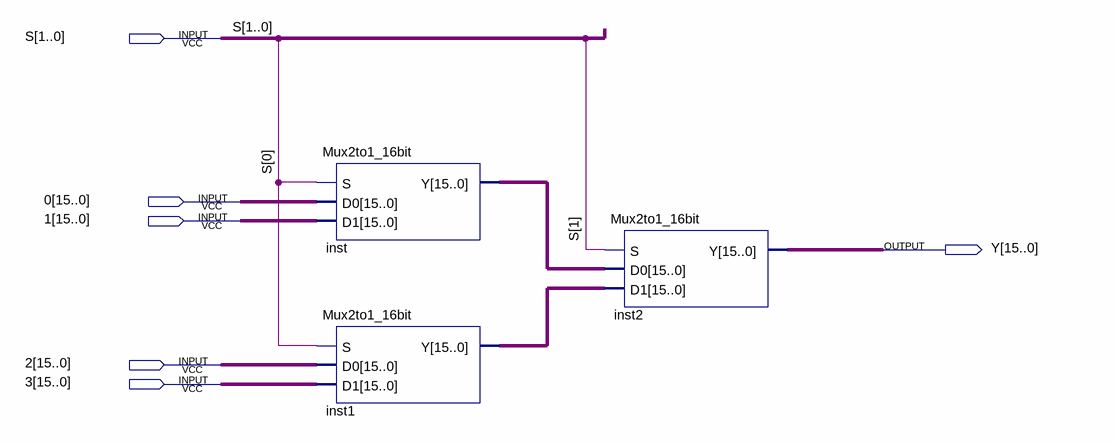
[diagram p0: schematic sheet]
// Quartus schematic Mux4to1_16bit.bdf as structural Verilog: 3 symbols, 6 pins
module Mux4to1_16bit (
  input  [1:0] S,
  input  [15:0] \0 ,
  input  [15:0] \1 ,
  input  [15:0] \2 ,
  input  [15:0] \3 ,
  output [15:0] Y
);

  wire [15:0] inst1_y, inst_y;

  Mux2to1_16bit inst (.S(S[0]), .D0(\0 ), .D1(\1 ), .Y(inst_y));
  Mux2to1_16bit inst1 (.S(S[0]), .D0(\2 ), .D1(\3 ), .Y(inst1_y));
  Mux2to1_16bit inst2 (.S(S[1]), .D0(inst_y), .D1(inst1_y), .Y(Y));
endmodule
